# Altium schematic sheet [05]USB_HUB.SchDoc
size B
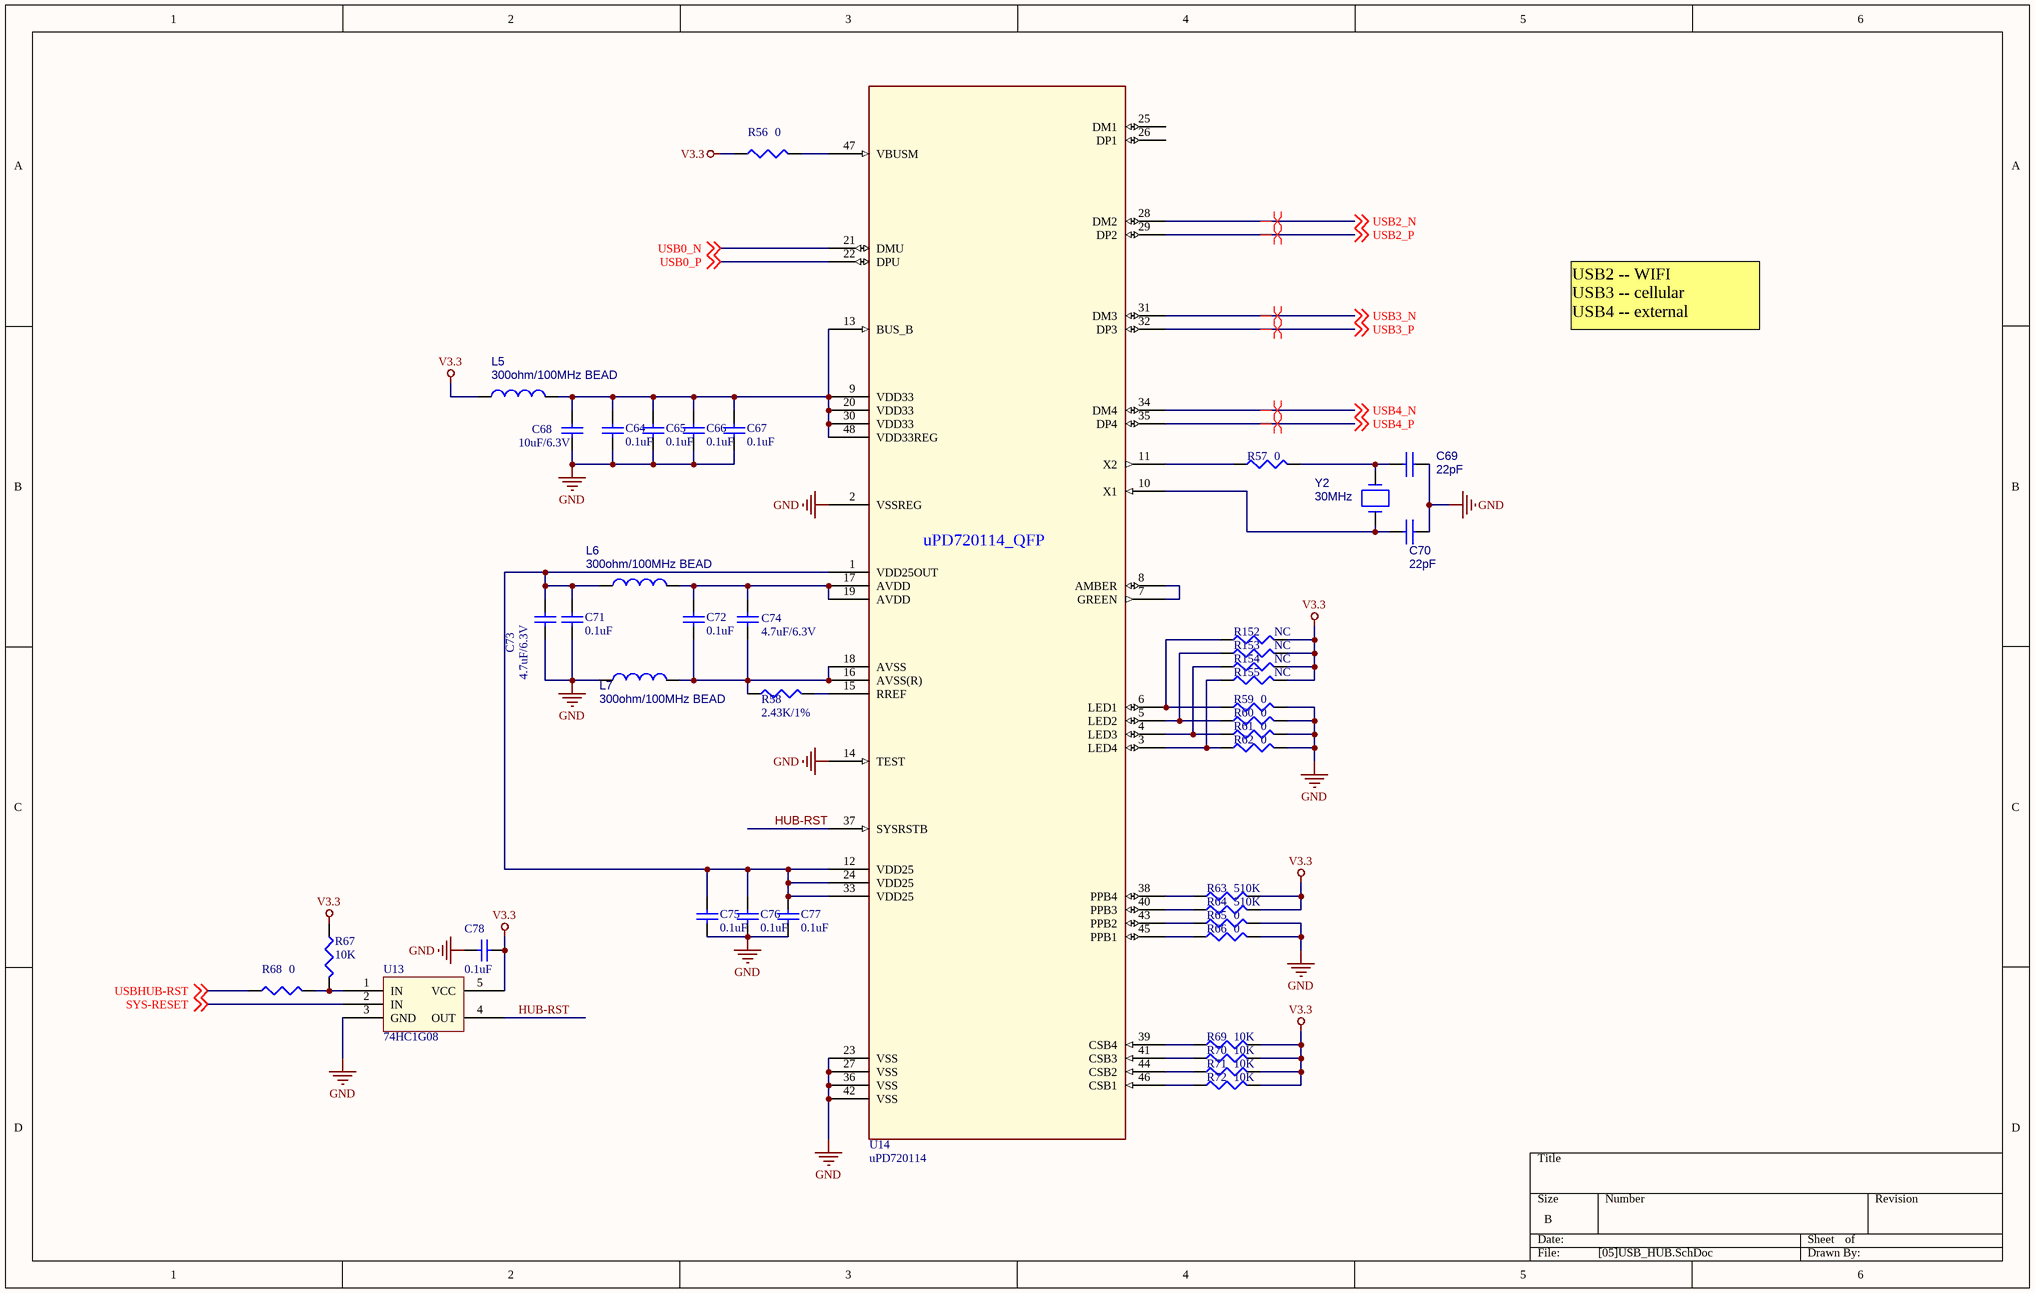
[diagram p0: [05]USB_HUB.SchDoc]

## Parts
C64  0.1uF  [0603]
C65  0.1uF  [0603]
C66  0.1uF  [0603]
C67  0.1uF  [0603]
C68  10uF/6.3V  [0805]
C69  22pF  [0603]
C70  22pF  [0603]
C71  0.1uF  [0603]
C72  0.1uF  [0603]
C73  4.7uF/6.3V  [0603]
C74  4.7uF/6.3V  [0603]
C75  0.1uF  [0603]
C76  0.1uF  [0603]
C77  0.1uF  [0603]
C78  0.1uF  [0603]
L5  300ohm/100MHz BEAD  [0603]
L6  300ohm/100MHz BEAD  [0603]
L7  300ohm/100MHz BEAD  [0603]
R56  0  [0603]
R57  0  [0603]
R58  2.43K/1%  [0603]
R59  0  [0603]
R60  0  [0603]
R61  0  [0603]
R62  0  [0603]
R63  510K  [0603]
R64  510K  [0603]
R65  0  [0603]
R66  0  [0603]
R67  10K  [0603]
R68  0  [0603]
R69  10K  [0603]
R70  10K  [0603]
R71  10K  [0603]
R72  10K  [0603]
R152  NC  [0603]
R153  NC  [0603]
R154  NC  [0603]
R155  NC  [0603]
U13  74HC1G08  [SOT23-5]
U14  uPD720114  [LQFP48]
Y2  30MHz  [XTAL_SMD]

## Nets
GND: C64.1 C65.1 C66.1 C67.1 C68.1 C69.1 C70.1 C71.1 C73.1 C75.1 C76.1 C77.1 C78.2 L7.2 R59.2 R60.2 R61.2 R62.2 R65.2 R66.2 U13.3(GND) U14.2(VSSREG) U14.14(TEST) U14.23(VSS) U14.27(VSS) U14.36(VSS) U14.42(VSS)
V3.3: C78.1 L5.2 R56.1 R63.2 R64.2 R67.1 R69.2 R70.2 R71.2 R72.2 R152.2 R153.2 R154.2 R155.2 U13.5(VCC)
HUB-RST: U13.4(OUT) U14.37(SYSRSTB)
SYS-RESET: U13.2(IN) ; off-sheet SYS-RESET
USB0_N: U14.21(DMU) ; off-sheet USB0_N
USB0_P: U14.22(DPU) ; off-sheet USB0_P
USB2_N: U14.28(DM2) ; off-sheet USB2_N
USB2_P: U14.29(DP2) ; off-sheet USB2_P
USB3_N: U14.31(DM3) ; off-sheet USB3_N
USB3_P: U14.32(DP3) ; off-sheet USB3_P
USB4_N: U14.34(DM4) ; off-sheet USB4_N
USB4_P: U14.35(DP4) ; off-sheet USB4_P
USBHUB-RST: R68.1 ; off-sheet USBHUB-RST
NetC64_2: C64.2 C65.2 C66.2 C67.2 C68.2 L5.1 U14.9(VDD33) U14.13(BUS_B) U14.20(VDD33) U14.30(VDD33) U14.48(VDD33REG)
NetC69_2: C69.2 R57.2 Y2.2
NetC70_2: C70.2 U14.10(X1) Y2.1
NetC71_2: C71.2 C73.2 C75.2 C76.2 C77.2 L6.2 U14.1(VDD25OUT) U14.12(VDD25) U14.24(VDD25) U14.33(VDD25)
NetC72_1: C72.1 C74.1 L7.1 R58.1 U14.16(AVSS(R)) U14.18(AVSS)
NetC72_2: C72.2 C74.2 L6.1 U14.17(AVDD) U14.19(AVDD)
NetR56_2: R56.2 U14.47(VBUSM)
NetR57_1: R57.1 U14.11(X2)
NetR58_2: R58.2 U14.15(RREF)
NetR59_1: R59.1 R152.1 U14.6(LED1)
NetR60_1: R60.1 R153.1 U14.5(LED2)
NetR61_1: R61.1 R154.1 U14.4(LED3)
NetR62_1: R62.1 R155.1 U14.3(LED4)
NetR63_1: R63.1 U14.38(PPB4)
NetR64_1: R64.1 U14.40(PPB3)
NetR65_1: R65.1 U14.43(PPB2)
NetR66_1: R66.1 U14.45(PPB1)
NetR67_2: R67.2 R68.2 U13.1(IN)
NetR69_1: R69.1 U14.39(CSB4)
NetR70_1: R70.1 U14.41(CSB3)
NetR71_1: R71.1 U14.44(CSB2)
NetR72_1: R72.1 U14.46(CSB1)
NetU14_7: U14.7(GREEN) U14.8(AMBER)

Not connected (* = marked no-connect by the designer): U14 25(DM1) 26(DP1)

## Layout directives
differential pair: USB2_N, USB2_P, USB3_N, USB3_P, USB4_N, USB4_P

## Notes on the sheet
- USB2 -- WIFI
  USB3 -- cellular
  USB4 -- external
- (in symbol upd720114_QFP_4) uPD720114_QFP

## Library data of the parts
C64-C68 C71-C78 = Cap: Capacitor
C69 C70 = CAP_Dup1
L5-L7 = INDUCTOR_4
R56-R72 R152-R155 = Res3: Resistor
U14 = upd720114_QFP_4
Y2 = CRYSTAL